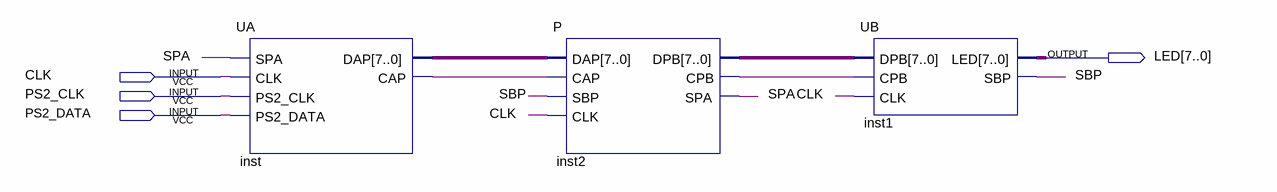
[diagram p0: schematic sheet]
// Quartus schematic Main.bdf as structural Verilog: 3 symbols, 4 pins
module Main (
  input  CLK,
  input  PS2_CLK,
  input  PS2_DATA,
  output [7:0] LED
);

  wire inst2_cpb, inst_cap, SBP, SPA;
  wire [7:0] inst2_dpb, inst_dap;

  UA inst (.SPA(SPA), .CLK(CLK), .PS2_CLK(PS2_CLK), .PS2_DATA(PS2_DATA), .DAP(inst_dap), .CAP(inst_cap));
  P inst2 (.DAP(inst_dap), .CAP(inst_cap), .SBP(SBP), .CLK(CLK), .DPB(inst2_dpb), .CPB(inst2_cpb), .SPA(SPA));
  UB inst1 (.DPB(inst2_dpb), .CPB(inst2_cpb), .CLK(CLK), .LED(LED), .SBP(SBP));
endmodule
